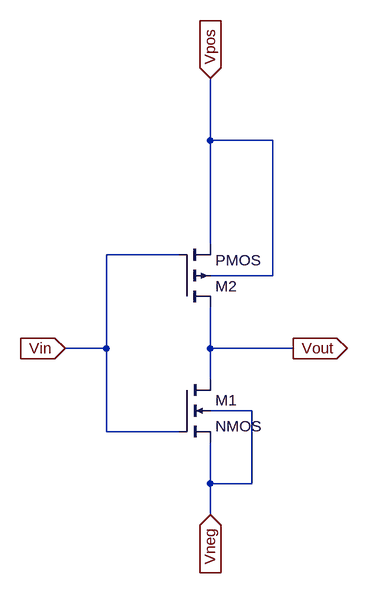
[diagram p0: schematic Inverter.asc]
Inverter.asc, the LTspice schematic file:
Version 4
SHEET 1 880 680
WIRE 112 -176 112 -272
WIRE 208 -176 112 -176
WIRE 112 -16 112 -176
WIRE 64 0 -48 0
WIRE 208 32 208 -176
WIRE 208 32 112 32
WIRE -48 144 -48 0
WIRE -48 144 -112 144
WIRE 112 144 112 80
WIRE 240 144 112 144
WIRE 112 192 112 144
WIRE 176 240 112 240
WIRE -48 272 -48 144
WIRE 64 272 -48 272
WIRE 112 352 112 288
WIRE 176 352 176 240
WIRE 176 352 112 352
WIRE 112 400 112 352
FLAG 112 -272 Vpos
IOPIN 112 -272 In
FLAG 240 144 Vout
IOPIN 240 144 Out
FLAG -112 144 Vin
IOPIN -112 144 In
FLAG 112 400 Vneg
IOPIN 112 400 In
SYMBOL nmos4 64 192 R0
SYMATTR InstName M1
SYMBOL pmos4 64 80 M180
SYMATTR InstName M2

The netlist it stands for:
* Inverter.asc
M1 Vout Vin Vneg Vneg NMOS
M2 Vout Vin Vpos Vpos PMOS
.model NMOS NMOS
.model PMOS PMOS
.lib standard.mos
.backanno
.end